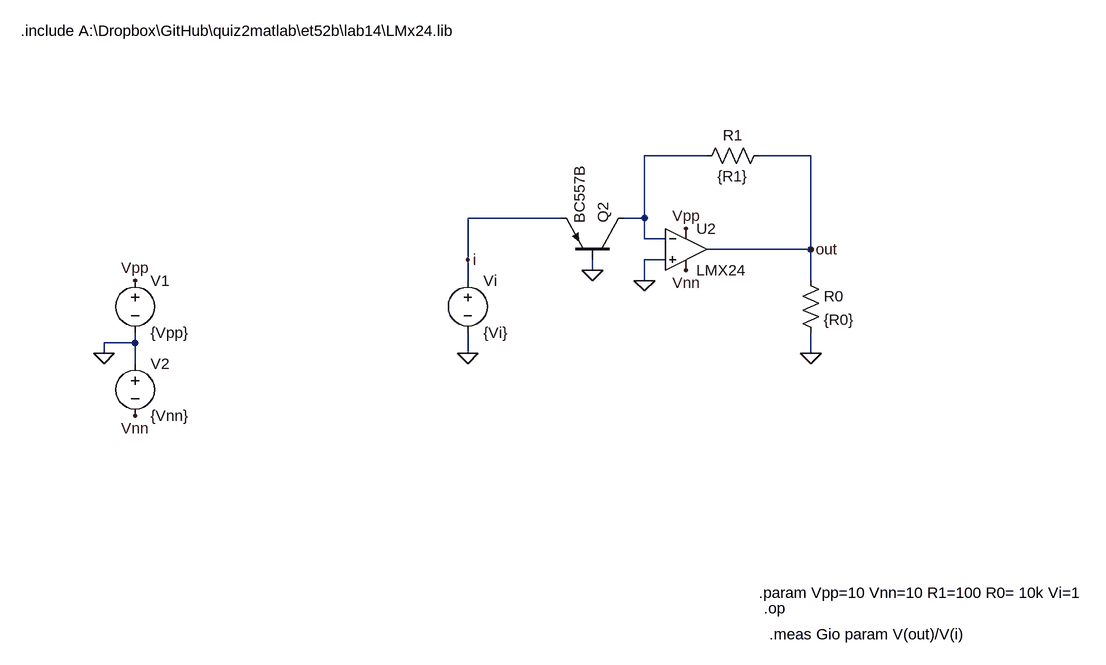
[diagram p0: schematic lab14c.asc]
lab14c.asc, the LTspice schematic file:
Version 4
SHEET 1 988 680
WIRE -192 -96 -288 -96
WIRE -32 -96 -112 -96
WIRE -416 0 -560 0
WIRE -288 0 -288 -96
WIRE -288 0 -320 0
WIRE -288 32 -288 0
WIRE -256 32 -288 32
WIRE -32 48 -32 -96
WIRE -32 48 -192 48
WIRE -560 64 -560 0
WIRE -256 64 -288 64
WIRE -368 80 -368 64
WIRE -560 96 -560 64
WIRE -288 96 -288 64
WIRE -32 96 -32 48
WIRE -1072 192 -1072 176
WIRE -1072 192 -1120 192
WIRE -1120 208 -1120 192
WIRE -560 208 -560 176
WIRE -32 208 -32 176
WIRE -1072 224 -1072 192
FLAG -1120 208 0
FLAG -1072 96 Vpp
FLAG -1072 304 Vnn
FLAG -560 208 0
FLAG -32 48 out
FLAG -32 208 0
FLAG -560 64 i
FLAG -288 96 0
FLAG -368 80 0
FLAG -224 16 Vpp
FLAG -224 80 Vnn
SYMBOL voltage -1072 80 R0
SYMATTR InstName V1
SYMATTR Value {Vpp}
SYMBOL voltage -1072 208 R0
SYMATTR InstName V2
SYMATTR Value {Vnn}
SYMBOL voltage -560 80 R0
SYMATTR InstName Vi
SYMATTR Value {Vi}
SYMBOL res -48 80 R0
SYMATTR InstName R0
SYMATTR Value {R0}
SYMBOL res -96 -112 R90
WINDOW 0 0 56 VBottom 2
WINDOW 3 32 56 VTop 2
SYMATTR InstName R1
SYMATTR Value {R1}
SYMBOL Opamps\\opamp2 -224 -16 R0
SYMATTR InstName U2
SYMATTR Value LMX24
SYMBOL pnp -320 64 M270
SYMATTR InstName Q2
SYMATTR Value BC557B
TEXT -1248 -288 Left 2 !.include A:\\Dropbox\\GitHub\\quiz2matlab\\et52b\\lab14\\LMx24.lib
TEXT -112 576 Left 2 !.param Vpp=10 Vnn=10 R1=100 R0= 10k Vi=1
TEXT -104 600 Left 2 !.op
TEXT -96 640 Left 2 !.meas Gio param V(out)/V(i)

The netlist it stands for:
* lab14c.asc
V1 Vpp 0 {Vpp}
V2 0 Vnn {Vnn}
Vi i 0 {Vi}
R0 out 0 {R0}
R1 out N001 {R1}
XU2 0 N001 Vpp Vnn out LMX24  ; pins In+ In- V+ V- OUT
Q2 N001 0 i 0 BC557B
.model NPN NPN
.model PNP PNP
.lib standard.bjt
.include A:\Dropbox\GitHub\quiz2matlab\et52b\lab14\LMx24.lib
.param Vpp=10 Vnn=10 R1=100 R0= 10k Vi=1
.op
.meas Gio param V(out)/V(i)
.backanno
.end